# EAGLE design sens (EAGLE 7.6.0)
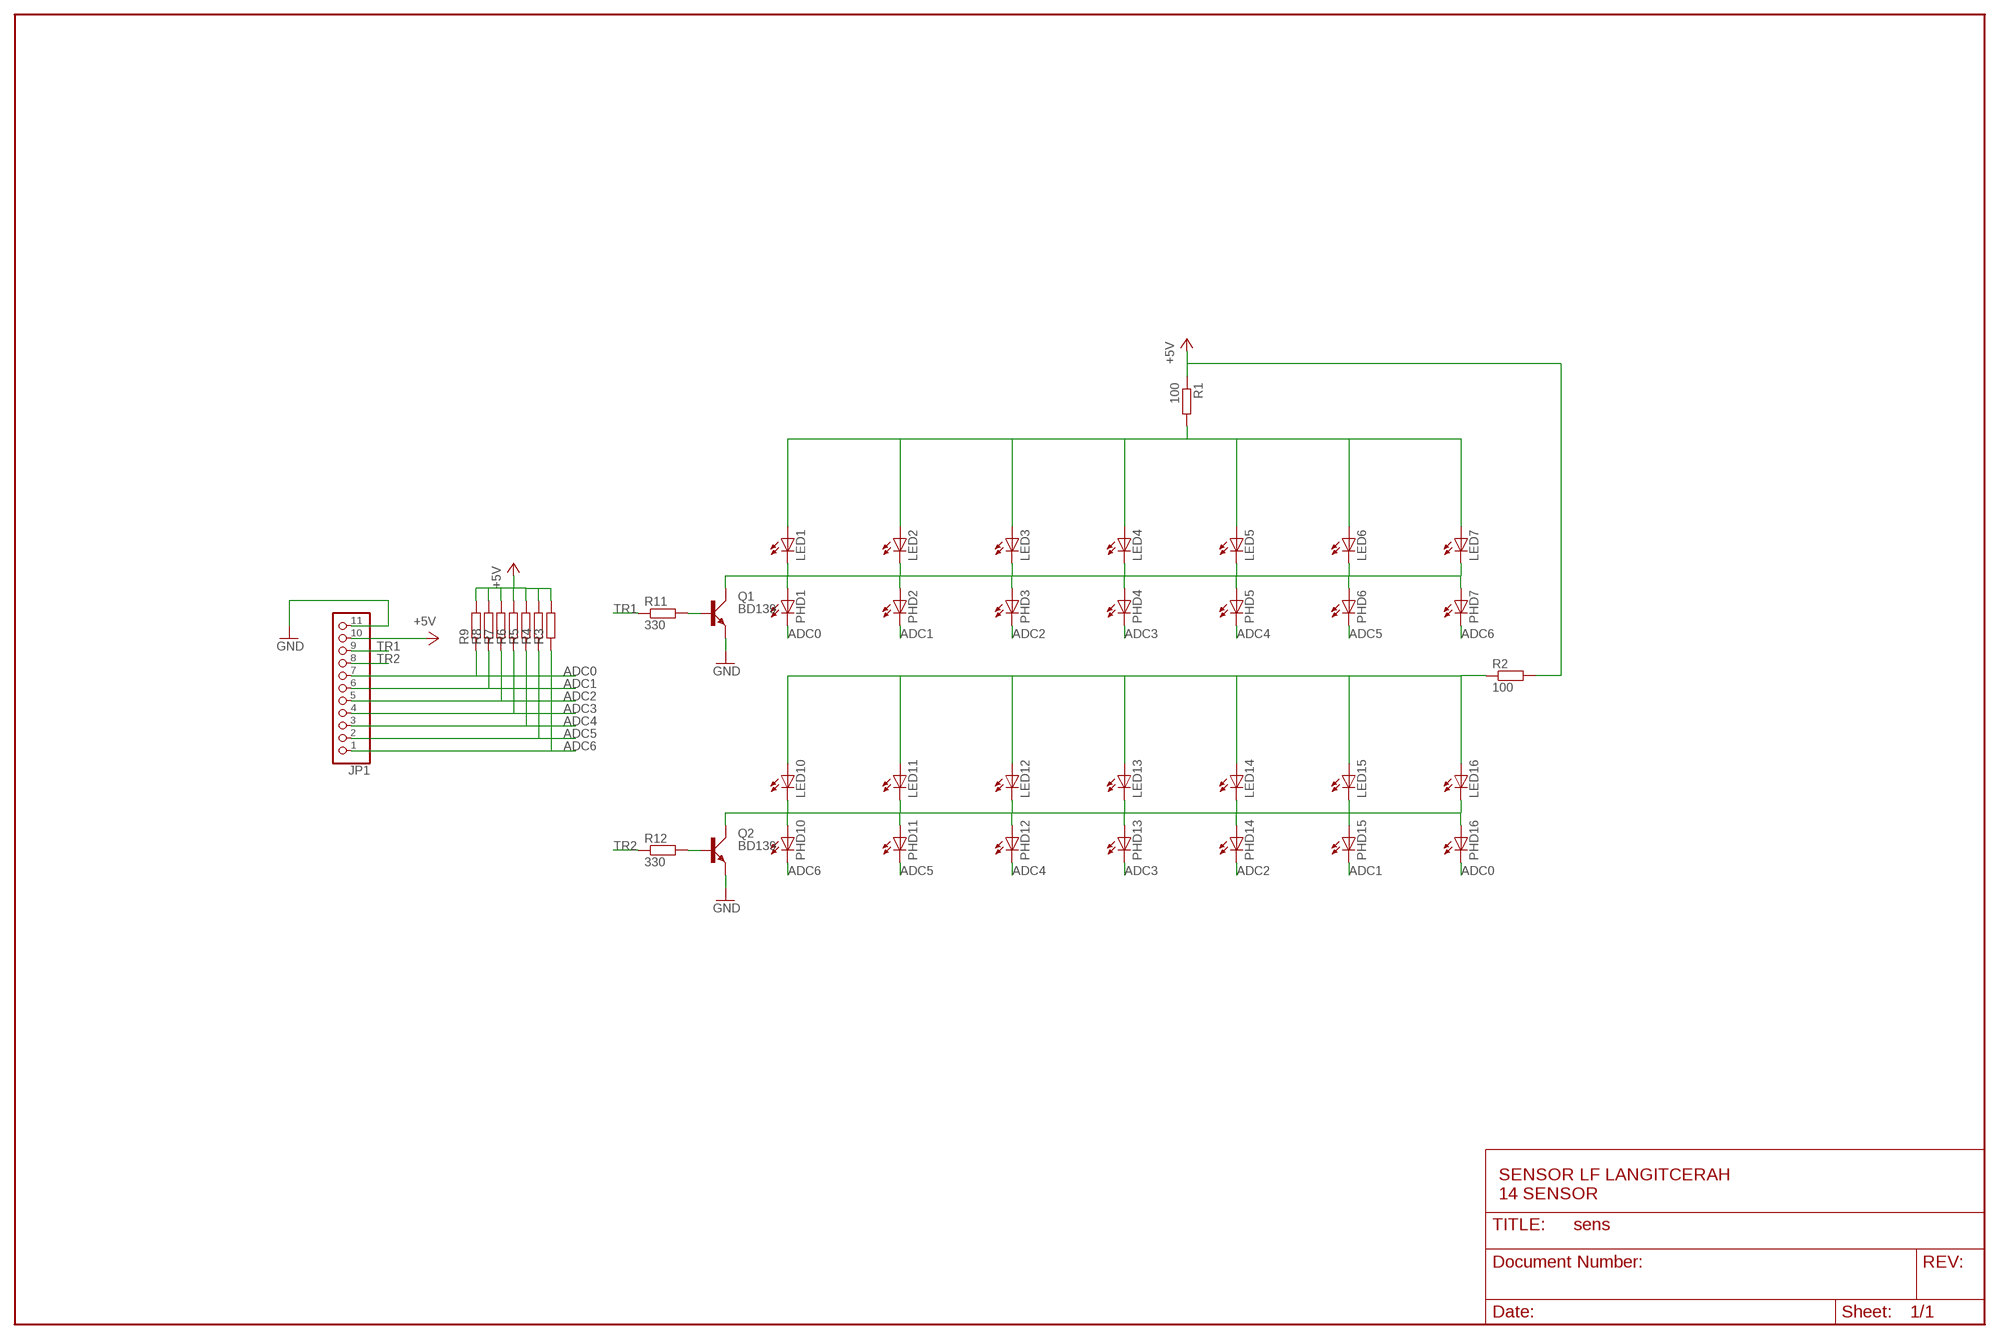
[diagram p0: schematic, sheet 1]

## Parts
JP1  PINHD-1X11  [1X11]
LED1  LED3MM  [LED3MM]
LED2  LED3MM  [LED3MM]
LED3  LED3MM  [LED3MM]
LED4  LED3MM  [LED3MM]
LED5  LED3MM  [LED3MM]
LED6  LED3MM  [LED3MM]
LED7  LED3MM  [LED3MM]
LED10  LED3MM  [LED3MM]
LED11  LED3MM  [LED3MM]
LED12  LED3MM  [LED3MM]
LED13  LED3MM  [LED3MM]
LED14  LED3MM  [LED3MM]
LED15  LED3MM  [LED3MM]
LED16  LED3MM  [LED3MM]
PHD1  LED3MM  [LED3MM]
PHD2  LED3MM  [LED3MM]
PHD3  LED3MM  [LED3MM]
PHD4  LED3MM  [LED3MM]
PHD5  LED3MM  [LED3MM]
PHD6  LED3MM  [LED3MM]
PHD7  LED3MM  [LED3MM]
PHD10  LED3MM  [LED3MM]
PHD11  LED3MM  [LED3MM]
PHD12  LED3MM  [LED3MM]
PHD13  LED3MM  [LED3MM]
PHD14  LED3MM  [LED3MM]
PHD15  LED3MM  [LED3MM]
PHD16  LED3MM  [LED3MM]
Q1  BD139  [TO126AV]
Q2  BD139  [TO126AV]
R1  100  R-EU_0207/10  [0207/10]
R2  100  R-EU_0207/10  [0207/10]
R3  R-EU_0207/10  [0207/10]
R4  R-EU_0207/10  [0207/10]
R5  R-EU_0207/10  [0207/10]
R6  R-EU_0207/10  [0207/10]
R7  R-EU_0207/10  [0207/10]
R8  R-EU_0207/10  [0207/10]
R9  R-EU_0207/10  [0207/10]
R11  330  R-EU_0207/10  [0207/10]
R12  330  R-EU_0207/10  [0207/10]

## Nets
+5V: JP1.10 R1.1 R2.2 R3.2 R4.2 R5.2 R6.2 R7.2 R8.2 R9.2
ADC0: JP1.7 PHD1.K(C) PHD16.K(C) R9.1
ADC1: JP1.6 PHD2.K(C) PHD15.K(C) R8.1
ADC2: JP1.5 PHD3.K(C) PHD14.K(C) R7.1
ADC3: JP1.4 PHD4.K(C) PHD13.K(C) R6.1
ADC4: JP1.3 PHD5.K(C) PHD12.K(C) R5.1
ADC5: JP1.2 PHD6.K(C) PHD11.K(C) R4.1
ADC6: JP1.1 PHD7.K(C) PHD10.K(C) R3.1
GND: JP1.11 Q1.E Q2.E
N$1: LED1.A LED2.A LED3.A LED4.A LED5.A LED6.A LED7.A R1.2
N$2: LED1.K(C) LED2.K(C) LED3.K(C) LED4.K(C) LED5.K(C) LED6.K(C) LED7.K(C) PHD1.A PHD2.A PHD3.A PHD4.A PHD5.A PHD6.A PHD7.A Q1.C
N$4: LED10.K(C) LED11.K(C) LED12.K(C) LED13.K(C) LED14.K(C) LED15.K(C) LED16.K(C) PHD10.A PHD11.A PHD12.A PHD13.A PHD14.A PHD15.A PHD16.A Q2.C
N$31: Q1.B R11.2
N$32: Q2.B R12.2
TEPI: LED10.A LED11.A LED12.A LED13.A LED14.A LED15.A LED16.A R2.1
TR1: JP1.9 R11.1
TR2: JP1.8 R12.1

## Notes on the sheet
- SENSOR LF LANGITCERAH
  14 SENSOR

## Library data of the parts
JP1 = pinhead:PINHD-1X11: PIN HEADER
LED1-LED7 LED10-LED16 PHD1-PHD7 PHD10-PHD16 = led:LED: LED OSRAM: - CHIPLED LG R971, LG N971, LY N971, LG Q971, LY Q971, LO R971, LY R971 LH N974, LH R974 LS Q976, LO Q976, LY Q976 LO Q996 - Hyper CHIPLED LW Q18S LB Q993, LB Q99A, LB R99A - SideLED LS A670, LO A670, LY A670, LG A670, LP A670 LB A673, LV A673, LT A673, LW A673 LH A674 LY A675 LS A676, LA A676, LO A676, LY A676, LW A676 LS A679, LY A679, LG A679 - Hyper Micro SIDELED® LS Y876, LA Y876, LO Y876, LY Y876 LT Y87S - SmartLED LW L88C, LW L88S LB L89C, LB L89S, LG L890 LS L89K, LO L89K, LY L89K LS L896, LA L896, LO L896, LY L896 - TOPLED LS T670, LO T670, LY T670, LG T670, LP T670 LSG T670, LSP T670, LSY T670, LOP T670, LYG T670 LG T671, LOG T671, LSG T671 LB T673, LV T673, LT T673, LW T673 LH T674 LS T676, LA T676, LO T676, LY T676, LB T676, LH T676, LSB T676, LW T676 LB T67C, LV T67C, LT T67C, LS T67K, LO T67K, LY T67K, LW E67C LS E67B, LA E67B, LO E67B, LY E67B, LB E67C, LV E67C, LT E67C LW T67C LS T679, LY T679, LG T679 LS T770, LO T770, LY T770, LG T770, LP T770 LB T773, LV T773, LT T773, LW T773 LH T774 LS E675, LA E675, LY E675, LS T675 LS T776, LA T776, LO T776, LY T776, LB T776 LHGB T686 LT T68C, LB T68C - Hyper Mini TOPLED® LB M676 - Mini TOPLED Santana® LG M470 LS M47K, LO M47K, LY M47K Source: http://www.osram.convergy.de LUXEON: - LUMILED® LXK2-PW12-R00, LXK2-PW12-S00, LXK2-PW14-U00, LXK2-PW14-V00 LXK2-PM12-R00, LXK2-PM12-S00, LXK2-PM14-U00 LXK2-PE12-Q00, LXK2-PE12-R00, LXK2-PE12-S00, LXK2-PE14-T00, LXK2-PE14-U00 LXK2-PB12-K00, LXK2-PB12-L00, LXK2-PB12-M00, LXK2-PB14-N00, LXK2-PB14-P00, LXK2-PB14-Q00 LXK2-PR12-L00, LXK2-PR12-M00, LXK2-PR14-Q00, LXK2-PR14-R00 LXK2-PD12-Q00, LXK2-PD12-R00, LXK2-PD12-S00 LXK2-PH12-R00, LXK2-PH12-S00 LXK2-PL12-P00, LXK2-PL12-Q00, LXK2-PL12-R00 Source: www.luxeon.com KINGBRIGHT: KA-3528ASYC Source: www.kingbright.com
Q1 Q2 = transistor-power:BD139: NPN TRANSISTOR
R1-R9 R11 R12 = resistor:R-EU_: RESISTOR, European symbol

## Net classes
0 default: clearance 0.205 mm

## Board
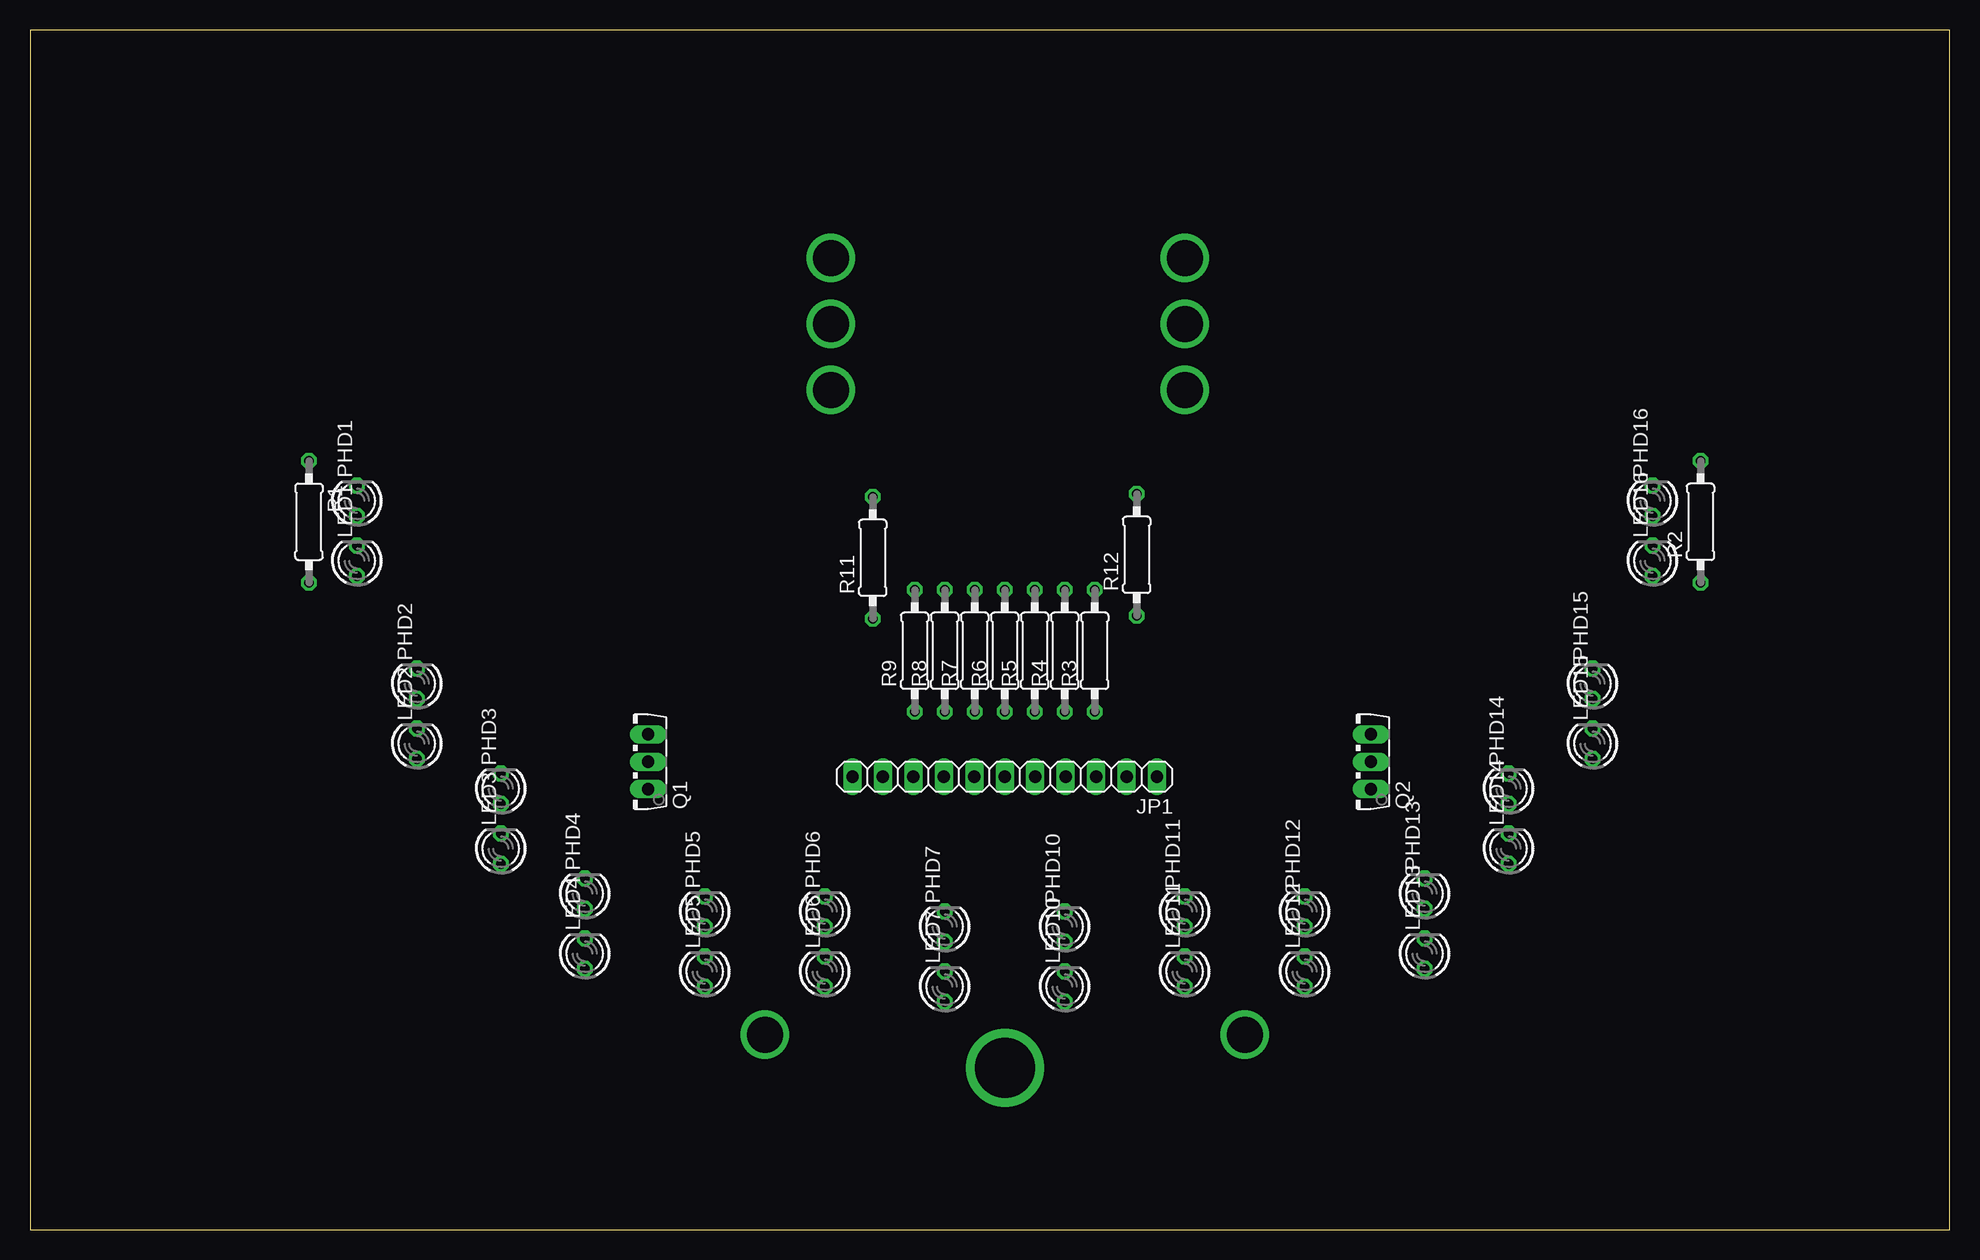
[diagram p1: board, top side]
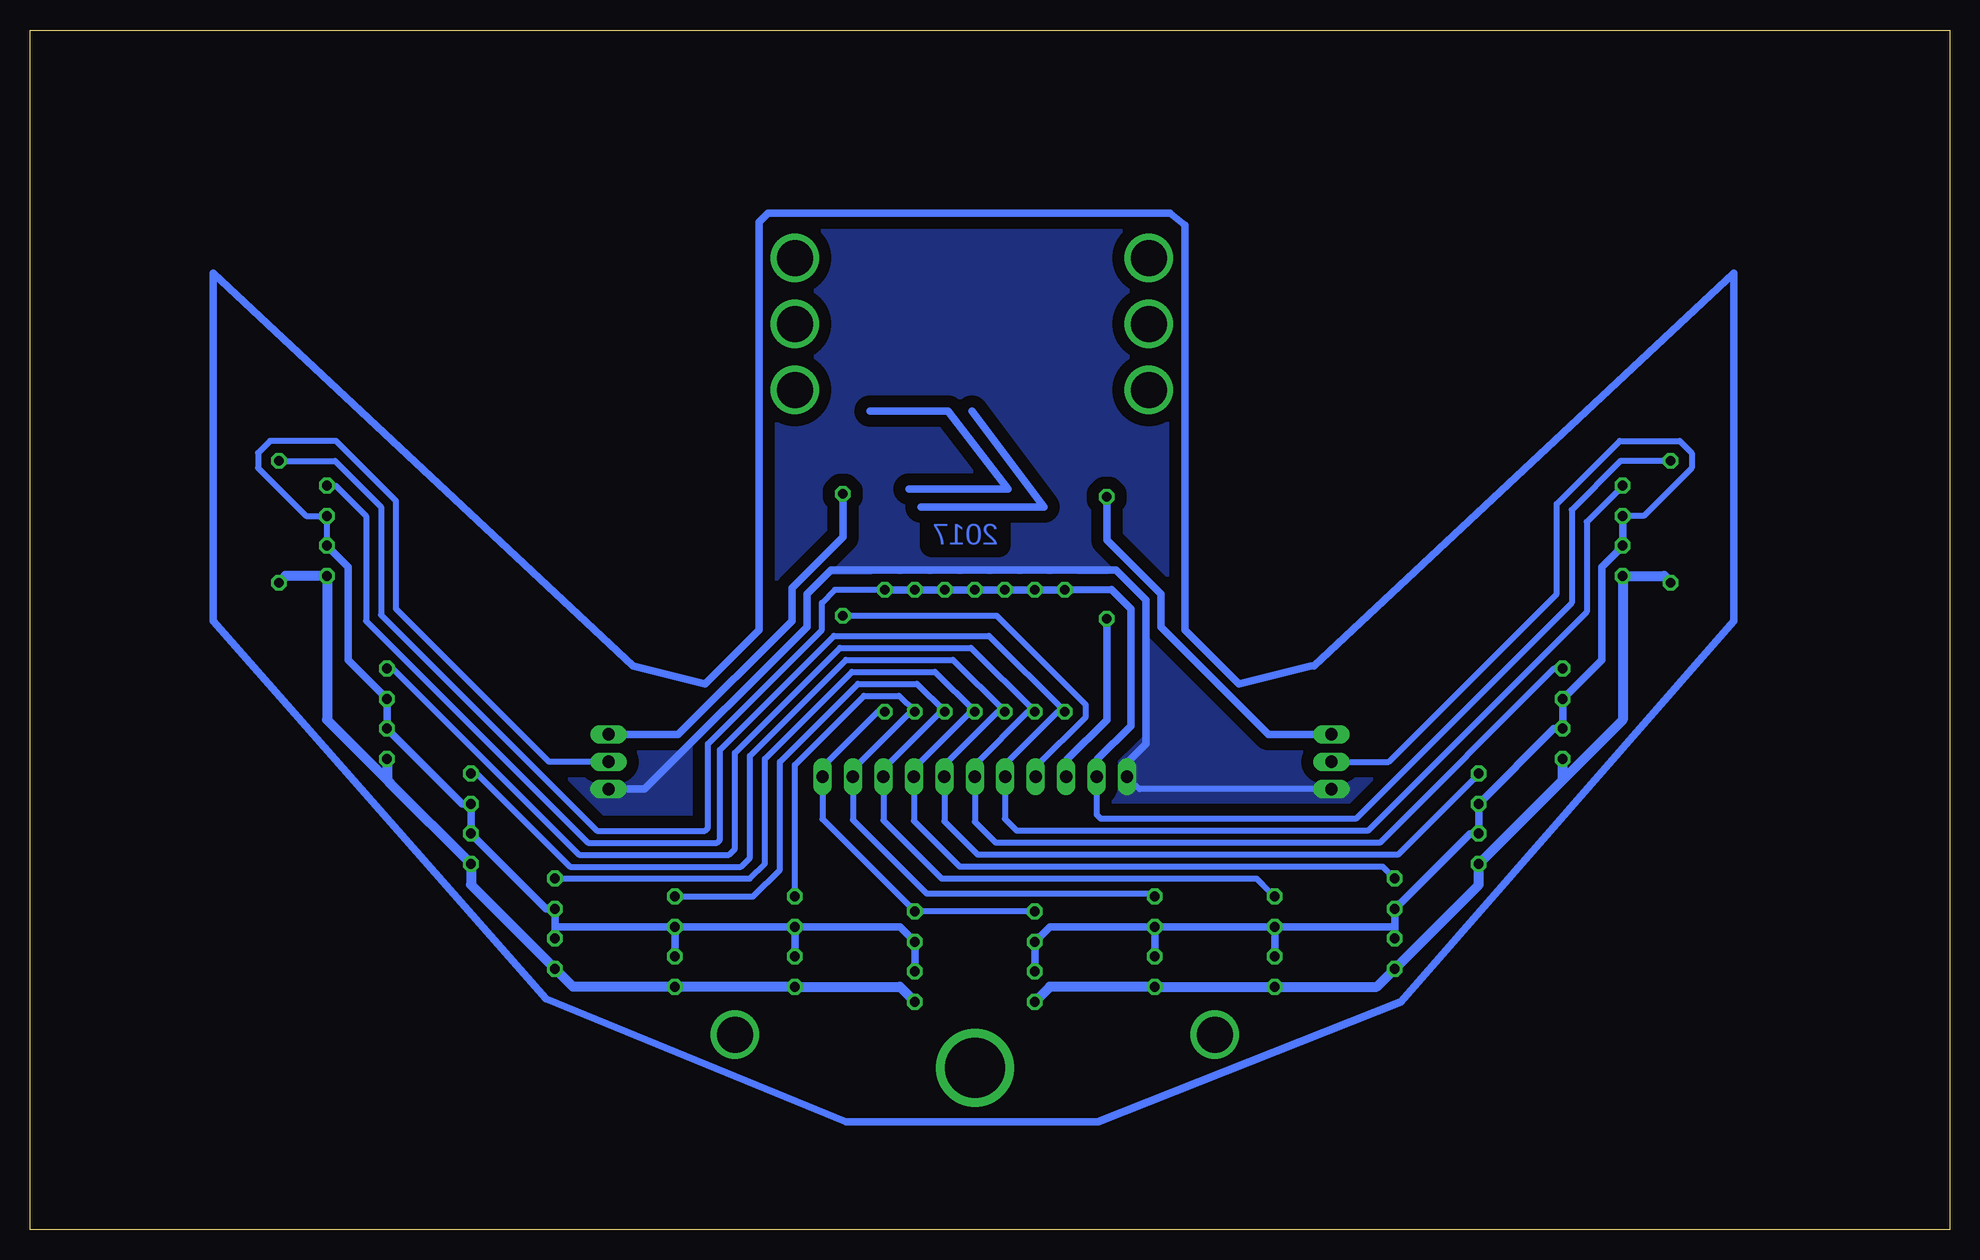
[diagram p2: board, bottom side, seen from below]

Size 160 x 100 mm. Coordinates in mm from the lower left corner, seen from the top.
Outline: 0,0 160,0 160,100 0,100 0,0
Copper layers (1*16): Top 0.035mm / dielectric 1.5mm / Bottom 0.035mm
Design rules "default": minimum track width 10mil, minimum drill 24mil, track to track 8mil, track to pad 8mil, pad to pad 8mil, via to via 8mil, smd to smd 8mil, copper to edge 40mil, drill to drill 8mil, minimum pad ring 10mil, minimum via ring 8mil, stop-mask expansion 4mil, vias tented up to drill 0mil, thermal gap 10mil

### Footprints (pad centres in the part's own frame; a part is rotated, then mirrored left to right if it is on the bottom)
1X11 = drill 1.016 long: 1 -12.7,0; 2 -10.16,0; 3 -7.62,0; 4 -5.08,0; 5 -2.54,0; 6 0,0; 7 2.54,0; 8 5.08,0; 9 7.62,0; 10 10.16,0; 11 12.7,0
LED3MM = drill 0.813 octagon: A -1.27,0; K 1.27,0
TO126AV = drill 1.016 long: B 2.286,-1.27; C 0,-1.27; E -2.286,-1.27
0207/10 = drill 0.813 octagon: 1 -5.08,0; 2 5.08,0

### Placement (x,y rotation side)
JP1  81.25,37.75 180 top
LED1  27.25,55.75 90 top
LED2  32.25,40.5 90 top
LED3  39.25,31.75 90 top
LED4  46.25,23 90 top
LED5  56.25,21.5 90 top
LED6  66.25,21.5 90 top
LED7  76.25,20.25 90 top
LED10  86.25,20.25 90 top
LED11  96.25,21.5 90 top
LED12  106.25,21.5 90 top
LED13  116.25,23 90 top
LED14  123.25,31.75 90 top
LED15  130.25,40.5 90 top
LED16  135.25,55.75 90 top
PHD1  27.25,60.75 90 top
PHD2  32.25,45.5 90 top
PHD3  39.25,36.75 90 top
PHD4  46.25,28 90 top
PHD5  56.25,26.5 90 top
PHD6  66.25,26.5 90 top
PHD7  76.25,25.25 90 top
PHD10  86.25,25.25 90 top
PHD11  96.25,26.5 90 top
PHD12  106.25,26.5 90 top
PHD13  116.25,28 90 top
PHD14  123.25,36.75 90 top
PHD15  130.25,45.5 90 top
PHD16  135.25,60.75 90 top
Q1  50.25,39 90 top
Q2  110.5,39 90 top
R1  23.25,59 270 top
R2  139.25,59 90 top
R3  88.75,48.25 90 top
R4  86.25,48.25 90 top
R5  83.75,48.25 90 top
R6  81.25,48.25 90 top
R7  78.75,48.25 90 top
R8  76.25,48.25 90 top
R9  73.75,48.25 90 top
R11  70.25,56 90 top
R12  92.25,56.25 90 top

### Tracks (layer width: path | path; a pad name or v marks a point on that pad's centre or on a via)
+5V
  Bottom 0.5: R1.1 27.42,64.08 31.5,60 31.5,52.25 49.5,34.25 70.75,34.25 71.09,34.59 JP1.10 | R2.2 134.58,64.08 130.75,60.25 130.75,51.25 112.75,33.25 103.75,33.25 103.5,33.5 103.5,40.5 94,50 94,52.25 92.92,53.33 R3.2
  Bottom 0.61: R3.2 R4.2 R5.2 R6.2 R7.2 R8.2 R9.2 69.84,53.34 68.25,51.75 68.25,42 71.04,39.21 JP1.10
ADC0
  Bottom 0.5: PHD1.K 27.25,62 30.25,59 30.25,51.5 48.5,33.25 77.75,33.25 78.75,34.25 78.75,38.06 JP1.7 78.71,38.79 74.33,43.17 R9.1 80.08,49.5 93,49.5 102.5,40 102.5,32.5 102.75,32.25 113.5,32.25 132,50.75 132,59.5 134.52,62.02 PHD16.K
ADC1
  Bottom 0.5: PHD2.K 32.98,46.77 47.5,32.25 79.5,32.25 81.25,34 JP1.6 81.25,38.75 76.83,43.17 R8.1 81.58,48.5 92.5,48.5 101.25,39.75 101.25,31.75 101.75,31.25 114.25,31.25 129.77,46.77 PHD15.K
ADC2
  Bottom 0.5: PHD3.K 39.25,38 46,31.25 81,31.25 83.79,34.04 JP1.5 83.79,38.71 79.33,43.17 R7.1 83.08,47.5 92,47.5 100,39.5 100,31 100.75,30.25 115,30.25 122.77,38.02 PHD14.K
ADC3
  Bottom 0.5: PHD4.K 46.27,29.27 47.25,30.25 82.5,30.25 86.33,34.08 JP1.4 86.33,38.42 81.58,43.17 R6.1 84.58,46.5 91.5,46.5 98.75,39.25 98.75,30.5 99.98,29.27 PHD13.K
ADC4
  Bottom 0.5: PHD5.K 57.23,28.75 57.25,28.75 57.75,29.25 84,29.25 88.87,34.12 JP1.3 88.87,38.38 84.08,43.17 R5.1 86.08,45.5 91,45.5 97.5,39 97.5,30 99.73,27.77 PHD12.K
ADC5
  Bottom 0.5: PHD6.K 66.27,27.77 66.5,28 85.25,28 91.41,34.16 JP1.2 91.41,38.34 86.58,43.17 R4.1 87.58,44.5 90.5,44.5 96.25,38.75 PHD11.K
ADC6
  Bottom 0.5: PHD7.K PHD10.K 93.95,34.22 JP1.1 93.95,38.55 89.33,43.17 R3.1
GND
  Bottom 0.5: Q1.E 67.51,36.71 JP1.11
  Bottom 0.61: JP1.11 68.5,39 67,40.5 67,52.5 69.5,55 93.25,55 95.25,53 95.25,50.25 108.79,36.71 Q2.E
  pour Bottom (isolate 1.016, no thermals): 65,84.75 98.5,84.75 99.25,84 99.25,50 103.75,45.5 109.75,47 144.75,79.75 144.75,51 117,19.25 92,9 71,9 45.75,19 18,50.75 18,79.75 53,47 59.25,45.5 63.75,50 63.75,83.75
N$1
  Bottom 0.813: LED7.A 75,20.23 LED6.A LED5.A 47.75,20.23 LED4.A 46.25,21.75 39.25,28.75 LED3.A 39.25,30.5 32.25,37.5 | 32.25,37.5 LED2.A | R1.2 23.81,54.48 LED1.A 27.25,42.5 32.25,37.5
N$2
  Bottom 0.5: PHD1.A 27.23,59.5 25.5,59.5 21.5,63.5 21.5,64.75 22.5,65.75 27.5,65.75 32.75,60.5 32.75,53 46.75,39 Q1.C
  Bottom 0.61: PHD5.A 56.02,25.23 56,25.25 46.25,25.25 | LED4.K 46.25,25.25 | 46.25,25.25 PHD4.A 46.25,26.75 40,33 39.27,33 LED3.K PHD3.A 32.96,41.77 LED2.K PHD2.A 29,47.48 29,55.25 27.25,57 LED1.K PHD1.A | PHD5.A PHD6.A | PHD6.A 75,25.23 PHD7.A LED7.K | PHD6.A LED6.K | PHD5.A LED5.K
N$3  (via drill 3 pad 2.54)
  other vias: 66.75,81
N$4
  Bottom 0.5: LED16.K PHD16.A 135.27,59.5 137,59.5 141,63.5 141,64.75 140,65.75 134.5,65.75 129.5,60.75 129.5,51.75 116.75,39 Q2.C
  Bottom 0.61: 135.36,59.69 PHD16.A | PHD11.A 87.5,25.23 PHD10.A LED10.K | PHD11.A LED11.K | PHD11.A PHD12.A | PHD12.A LED12.K | PHD12.A 116.23,25.23 116.25,25.25 | 116.25,25.25 PHD13.A 116.27,26.75 117,26.75 123.25,33 LED14.K PHD14.A 123.27,35.5 124,35.5 130.25,41.75 LED15.K PHD15.A 133.5,47.48 133.5,55.25 135.25,57 LED16.K | 116.25,25.25 LED13.K
N$7  (via drill 3 pad 2.54)
  other vias: 96.25,81
N$15  (via drill 5 pad 6.5)
  other vias: 81.25,13.5
N$16
  Bottom 0.61: 81.5,68.25 75.5,60.25 85.75,60.25
N$17
  Bottom 0.61: 86.75,61.75 78.5,61.75 83.5,68.25 90,68.25
N$18
  Bottom 0.5: 53,47 53.25,47
  Bottom 0.61: 53,47 18,79.75 18,50.75 45.75,19 71,9 92,9 117,19.25 144.75,50.75 144.75,79.75 109.75,47 103.75,45.5 99.25,50 99.25,84 98.5,84.75 65,84.75 63.75,83.75 63.75,50 59.25,45.5 53.25,47
N$19  (via drill 3 pad 2.54)
  other vias: 66.75,75.5
N$20  (via drill 3 pad 2.54)
  other vias: 96.25,75.5
N$21  (via drill 3)
  other vias: 66.75,70
N$22  (via drill 3)
  other vias: 96.25,70
N$23  (via drill 3)
  other vias: 61.25,16.25
N$24  (via drill 3)
  other vias: 101.25,16.25
N$31
  Bottom 0.61: R11.2 70.25,57.5 65.75,53 65.75,50.25 56.79,41.29 Q1.B
N$32
  Bottom 0.61: R12.2 92.25,57.75 96.5,53.5 96.5,50.75 105.96,41.29 Q2.B
TEPI
  Bottom 0.813: R2.1 138.69,54.48 LED16.A 135.25,42.48 130.25,37.48 | LED15.A 130.25,37.48 | 130.25,37.48 130.01,37.24 LED14.A 123.25,28.73 LED13.A 114.75,20.23 LED12.A LED11.A 87.5,20.23 LED10.A
TR1
  Bottom 0.61: R11.1 70.25,42.5 73.58,39.17 JP1.9
TR2
  Bottom 0.5: R12.1 79.42,51.17 72,43.75 72,42.75 76.12,38.63 JP1.8

### Text on the board
Bottom: 2017